# Altium schematic sheet Watchdog.SchDoc: RespiraWorks
size A3; CompanyName: RespiraWorks; DrawnBy: E. Chiu; Organization: Altium; DocumentNumber: 5; Revision: A1; SheetNumber: 5; SheetTotal: 8; PageSetup: Record=PageOptions|CenterHorizontal=True|CenterVertical=True|PrintScale=0.67|XCorrection=1.00|YCorrection=1.00|PrintKind=0|BorderSize=5000000|LeftOffset=0|BottomOffset=0|Orientation=2|PaperLength=1000|PaperWidth=1000|Scale=100|PaperSource=276|PrintQuality=-3|MediaType=1|DitherType=10|PrintScaleMode=1|PaperKind=11"x17" 279.4x431.8mm|PaperIndex=3; ProjectName: FALCON 3S
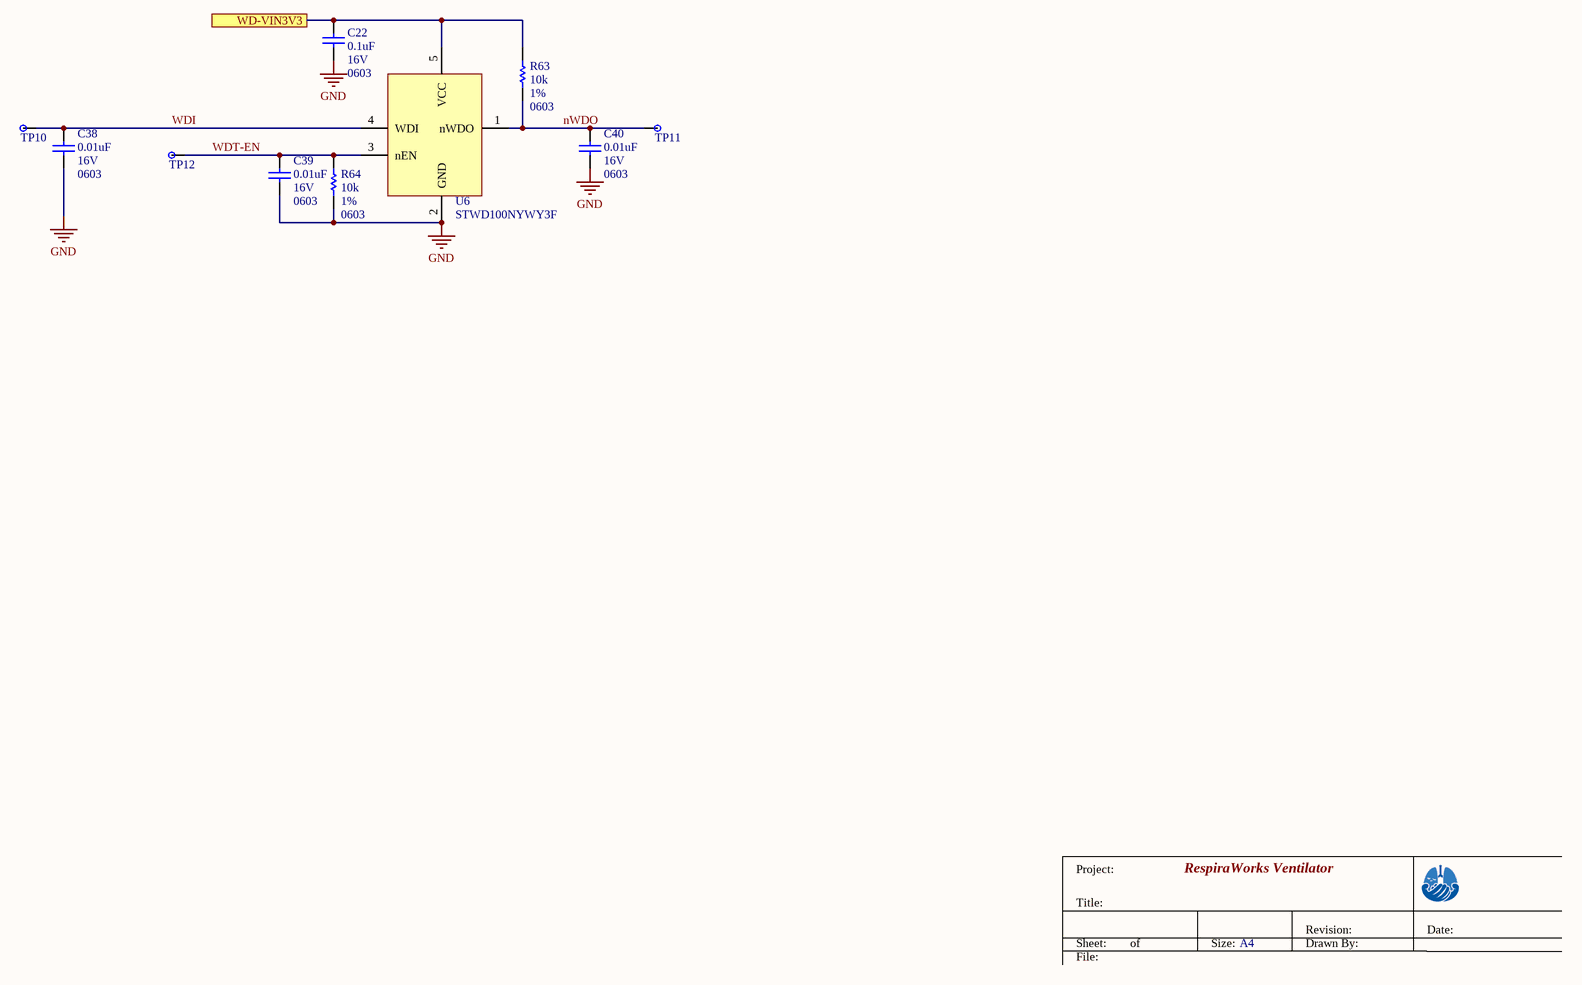
[diagram p0: Watchdog.SchDoc]

## Parts
C22  value 0.1uF  Voltage: 16V  PCB Package: 0603  [CAP0603]  (hidden comment: CAP 0603)
C38  value 0.01uF  Voltage: 16V  PCB Package: 0603  [CAP0603]  (hidden comment: CAP 0603)
C39  value 0.01uF  Voltage: 16V  PCB Package: 0603  [CAP0603]  (hidden comment: CAP 0603)
C40  value 0.01uF  Voltage: 16V  PCB Package: 0603  [CAP0603]  (hidden comment: CAP 0603)
R63  value 10k  PCB Package: 0603  Tolerance: 1%  [RES0603]  (hidden comment: RES 0603)
R64  value 10k  PCB Package: 0603  Tolerance: 1%  [RES0603]  (hidden comment: RES 0603)
TP10  TP-SMT  [TP-5015]  (value not drawn)
TP11  TP-SMT  [TP-5015]  (value not drawn)
TP12  TP-SMT  [TP-5015]  (value not drawn)
U6  STWD100NYWY3F  [5-SOT23]

## Ports
WD-VIN3V3

## Nets
GND: C22.2 C38.2 C39.2 C40.2 R64.1 U6.2(GND)
nWDO: C40.1 R63.1 TP11.1 U6.1(nWDO)
WD-VIN3V3: C22.1 R63.2 U6.5(VCC) ; port WD-VIN3V3
WDI: C38.1 TP10.1 U6.4(WDI)
WDT-EN: C39.1 R64.2 TP12.1 U6.3(nEN)

## Notes on the sheet
- Project:
- RespiraWorks Ventilator
- Title:
- Sheet:
- of
- Size:
- A4
- Drawn By:
- Revision:
- Date:
- File:

## Library data of the parts
C22 = CAP 0603: Manufacturer P/N: CC0603KRX7R7BB104; Manufacturer: Yageo; Type: X7R; Do Not Populate: *
C38-C40 = CAP 0603: Manufacturer P/N: CL10B103KO8NNNC; Manufacturer: Samsung; Type: X7R; Do Not Populate: *
R63 R64 = RES 0603: Manufacturer P/N: ERJ-3EKF1002V; Manufacturer: Panasonic; Do Not Populate: *
TP10-TP12 = TP-SMT: Keystone 5015 SMT Mini Testpoint; Manufacturer P/N: 5015; Manufacturer: Keystone; PCB Package: TP-5015; Tolerance: 5015; Do Not Populate: *; Value: *
U6 = STWD100NYWY3F: Watchdog Timer Circuit, 1.6s timeout; Manufacturer: ST; PCB Package: SOT-23-5; Manufacturer P/N: STWD100NYWY3F; Timeout: 1.6s; Do Not Populate: *